# Altium schematic sheet servo.SchDoc
size A
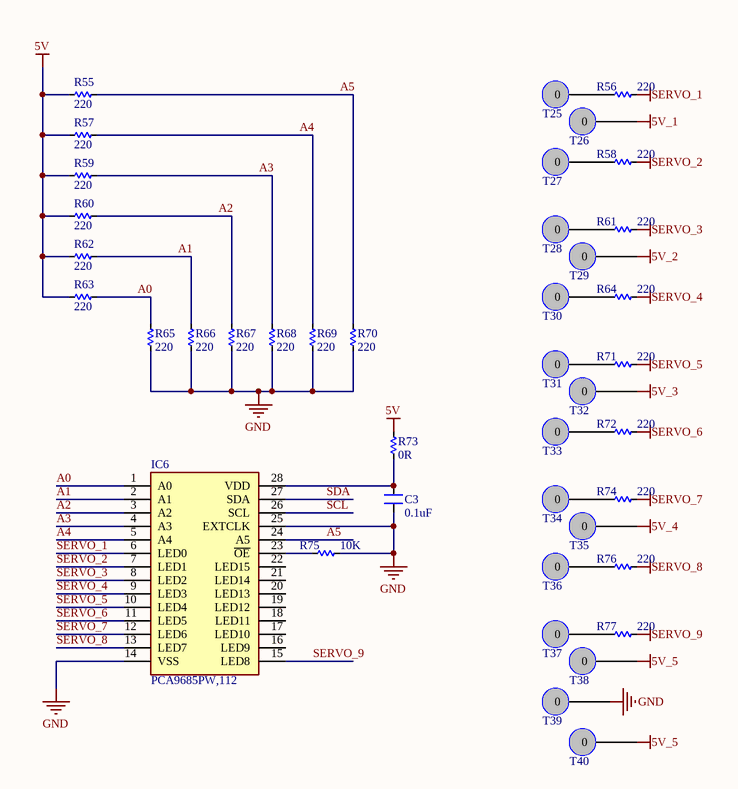
[diagram p0: servo.SchDoc]

## Parts
C3  0.1uF  [CN-SMD-0603]
IC6  PCA9685PW,112  [SOP65P640X110-28N]
R55  220  [RES-SMD-0603]
R56  220  [RES-SMD-0603]
R57  220  [RES-SMD-0603]
R58  220  [RES-SMD-0603]
R59  220  [RES-SMD-0603]
R60  220  [RES-SMD-0603]
R61  220  [RES-SMD-0603]
R62  220  [RES-SMD-0603]
R63  220  [RES-SMD-0603]
R64  220  [RES-SMD-0603]
R65  220  [RES-SMD-0603]
R66  220  [RES-SMD-0603]
R67  220  [RES-SMD-0603]
R68  220  [RES-SMD-0603]
R69  220  [RES-SMD-0603]
R70  220  [RES-SMD-0603]
R71  220  [RES-SMD-0603]
R72  220  [RES-SMD-0603]
R73  0R  [RES-SMD-0603]
R74  220  [RES-SMD-0603]
R75  10K  [RES-SMD-0603]
R76  220  [RES-SMD-0603]
R77  220  [RES-SMD-0603]
T25  Pad  [PCBComponent_1]  (value not drawn)
T26  Pad  [PCBComponent_1]  (value not drawn)
T27  Pad  [PCBComponent_1]  (value not drawn)
T28  Pad  [PCBComponent_1]  (value not drawn)
T29  Pad  [PCBComponent_1]  (value not drawn)
T30  Pad  [PCBComponent_1]  (value not drawn)
T31  Pad  [PCBComponent_1]  (value not drawn)
T32  Pad  [PCBComponent_1]  (value not drawn)
T33  Pad  [PCBComponent_1]  (value not drawn)
T34  Pad  [PCBComponent_1]  (value not drawn)
T35  Pad  [PCBComponent_1]  (value not drawn)
T36  Pad  [PCBComponent_1]  (value not drawn)
T37  Pad  [PCBComponent_1]  (value not drawn)
T38  Pad  [PCBComponent_1]  (value not drawn)
T39  Pad  [PCBComponent_1]  (value not drawn)
T40  Pad  [PCBComponent_1]  (value not drawn)

## Nets
5V: R55.2 R57.2 R59.2 R60.2 R62.2 R63.2 R73.1
5V_1: T26.0
5V_2: T29.0
5V_3: T32.0
5V_4: T35.0
5V_5: T38.0 T40.0
GND: C3.1 IC6.14(VSS) IC6.25(EXTCLK) R65.2 R66.2 R67.2 R68.2 R69.2 R70.2 R75.2 T39.0
SERVO_1: IC6.6(LED0) R56.1
SERVO_2: IC6.7(LED1) R58.1
SERVO_3: IC6.8(LED2) R61.1
SERVO_4: IC6.9(LED3) R64.1
SERVO_5: IC6.10(LED4) R71.1
SERVO_6: IC6.11(LED5) R72.1
SERVO_7: IC6.12(LED6) R74.1
SERVO_8: IC6.13(LED7) R76.1
SERVO_9: IC6.15(LED8) R77.1
A0: IC6.1(A0) R63.1 R65.1
A1: IC6.2(A1) R62.1 R66.1
A2: IC6.3(A2) R60.1 R67.1
A3: IC6.4(A3) R59.1 R68.1
A4: IC6.5(A4) R57.1 R69.1
A5: IC6.24(A5) R55.1 R70.1
SCL: IC6.26(SCL)
SDA: IC6.27(SDA)
NetC3_2: C3.2 IC6.28(VDD) R73.2
NetIC6_23: IC6.23(~{OE}) R75.1
NetR56_2: R56.2 T25.0
NetR58_2: R58.2 T27.0
NetR61_2: R61.2 T28.0
NetR64_2: R64.2 T30.0
NetR71_2: R71.2 T31.0
NetR72_2: R72.2 T33.0
NetR74_2: R74.2 T34.0
NetR76_2: R76.2 T36.0
NetR77_2: R77.2 T37.0

Not connected (* = marked no-connect by the designer): IC6 16(LED9) 17(LED10) 18(LED11) 19(LED12) 20(LED13) 21(LED14) 22(LED15)

## Library data of the parts
C3 = CN: Tu gom; Value: 33pF
IC6 = PCA9685PW,112: Integrated Circuit; Manufacturer_Name: NXP; Datasheet Link: http://www.nxp.com/docs/en/data-sheet/PCA9685.pdf; Height: 1.1mm; Manufacturer_Part_Number: PCA9685PW,112; Mouser Part Number: 771-PCA9685PW,112; Mouser Price/Stock: https://www.mouser.co.uk/ProductDetail/NXP-Semiconductors/PCA9685PW112?qs=6YAT8rHPFU9wZqiAeiOMZw%3D%3D; Arrow Part Number: PCA9685PW,112; Arrow Price/Stock: https://www.arrow.com/en/products/pca9685pw112/nxp-semiconductors?region=nac
R55-R77 = Res-SMD: Resistor; Manufacturer: Generic Components; Class: Passive; Published: 08/06/2000; Publisher: Altium Hobart Technology Centre
T25-T40 = Component_1